# EAGLE design rapidshark_mark_6.12 (EAGLE 6.5.0)
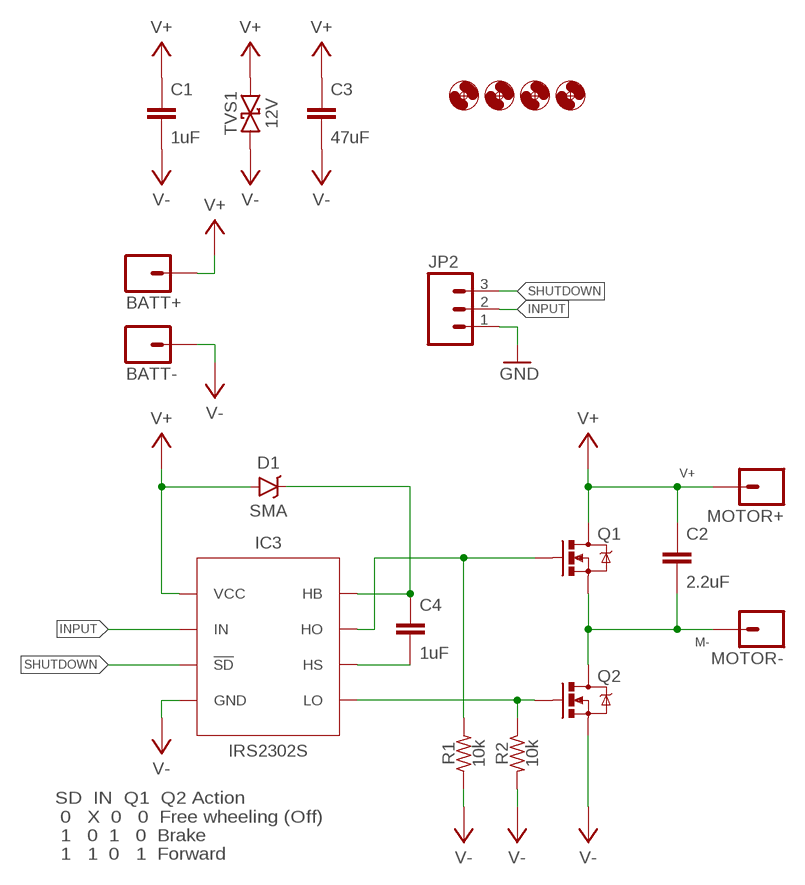
[diagram p0: schematic, sheet 1]

## Parts
BATT+  M01PTH_2MM  [1X01_2MM]
BATT-  M01PTH_2MM  [1X01_2MM]
C1  1uF  CAPACITOR-CERAMICC0805  [C0805]
C2  2.2uF  CAPACITOR-CERAMICC0805  [C0805]
C3  47uF  CAPACITOR-CERAMICC1206  [C1206]
C4  1uF  CAPACITOR-CERAMICC0805  [C0805]
D1  SMA  DIODE-SCHOTTKYSMA  [SMA-DIODE-SCHOTTKY]
H1  HOLE#2  [HOLE-#2]
H2  HOLE#2  [HOLE-#2]
H3  HOLE#2  [HOLE-#2]
H4  HOLE#2  [HOLE-#2]
IC3  IRS2302S  [SO08]
JP2  M03PTH  [1X03]
MOTOR+  M01PTH_2MM  [1X01_2MM]
MOTOR-  M01PTH_2MM  [1X01_2MM]
Q1  MOSFET-NCHANNELPSMN4R0-30YLD  [LFPAK56]
Q2  MOSFET-NCHANNELPSMN4R0-30YLD  [LFPAK56]
R1  10k  RESISTORR0805  [R0805]
R2  10k  RESISTORR0805  [R0805]
TVS1  12V  TVSSMA  [SMA-DIODE-TVS-BIDIR]

## Nets
GND: JP2.1
INPUT: IC3.2(IN) JP2.2
M-: C2.2 MOTOR-.1 Q1.1(S) Q1.2(S) Q1.3(S) Q2.MB@1(D) Q2.MB@2(D)
N$2: IC3.7(HO) Q1.4(G) R1.2
N$3: IC3.5(LO) Q2.4(G) R2.1
N$6: C4.1 D1.C IC3.8(HB)
N$7: C4.2 IC3.6(HS)
SHUTDOWN: IC3.3(!SD) JP2.3
V+: BATT+.1 C1.1 C2.1 C3.1 D1.A IC3.1(VCC) MOTOR+.1 Q1.MB@1(D) Q1.MB@2(D) TVS1.1
V-: BATT-.1 C1.2 C3.2 IC3.4(GND) Q2.1(S) Q2.2(S) Q2.3(S) R1.1 R2.2 TVS1.2

## Notes on the sheet
- SD  IN  Q1  Q2 Action
   0   X  0   0  Free wheeling (Off)
   1   0  1   0  Brake
   1   1  0   1  Forward

## Library data of the parts
BATT+ BATT- MOTOR+ MOTOR- = A_butts:M01: Header 1 Standard 1-pin 0.1" header. Use with straight break away headers (SKU : PRT-00116), right angle break away headers (PRT-00553), swiss pins (PRT-00743), machine pins (PRT-00117), and female headers (PRT-00115).
C1-C4 = A_butts:CAPACITOR-CERAMIC: CAPACITOR, European symbol
D1 = A_butts:DIODE-SCHOTTKY: Schottky diodes in SFE's production catalog BAT20J 1A 23V 0.62Vf RB751 120mA 40V 0.37Vf PMEG4005EJ 0.5A 40V 0.42Vf MBRA140 1A 40V 0.5Vf B340A 3A 40V SMA
H1-H4 = A_butts:HOLE: MOUNTING HOLE with drill center marker
IC3 = A_butts:IRS2302S
JP2 = A_butts:M03: Header 3 Standard 3-pin 0.1" header. Use with straight break away headers (SKU : PRT-00116), right angle break away headers (PRT-00553), swiss pins (PRT-00743), machine pins (PRT-00117), and female headers (PRT-00115). Molex polarized connector foot print use with SKU : PRT-08232 with associated crimp pins and housings.
Q1 Q2 = A_butts:MOSFET-NCHANNEL: Common NMOSFET Parts MFG P/N Store ID Prod ID FDD8780 TRANS-09984 SI7820DN TRANS-11055 FDS6630A IC-08089 2N7002PW TRANS-11151 FQP30N06L COM-10213 TRANS-10060 BSS123LT1G TRANS-08345 BSS138 TRANS-00830 BS170 2N7000
R1 R2 = A_butts:RESISTOR: RESISTOR, American symbol
TVS1 = A_butts:TVS: Transient voltage suppressor- prevents ESD on inputs. Ignore package description- MBRA140 is NOT this type of part!!!

## Board
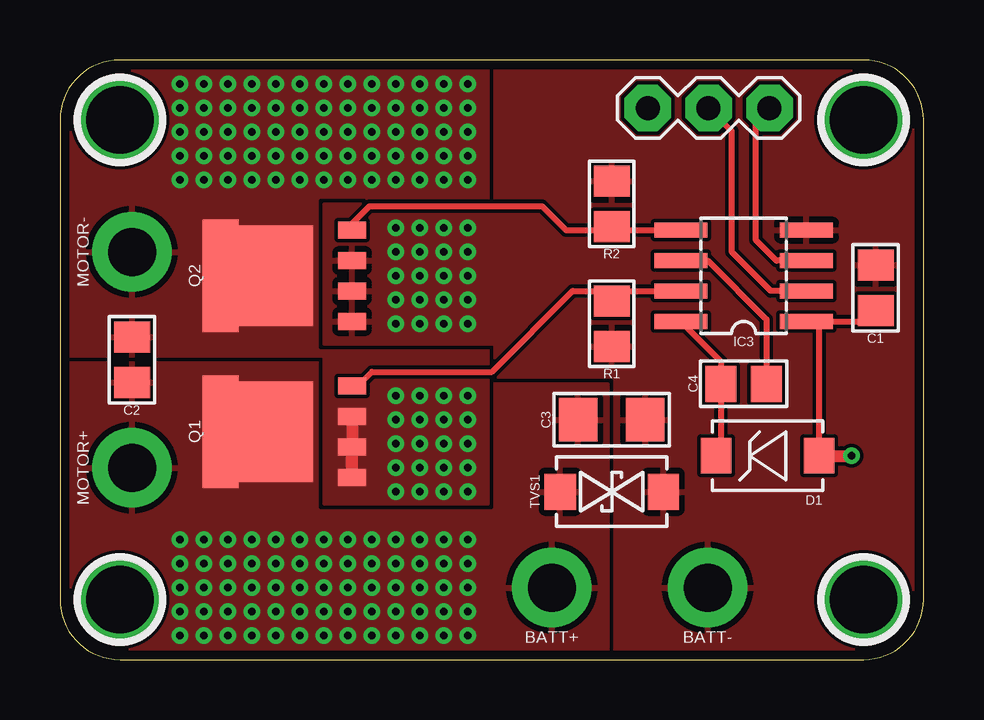
[diagram p1: board, top side]
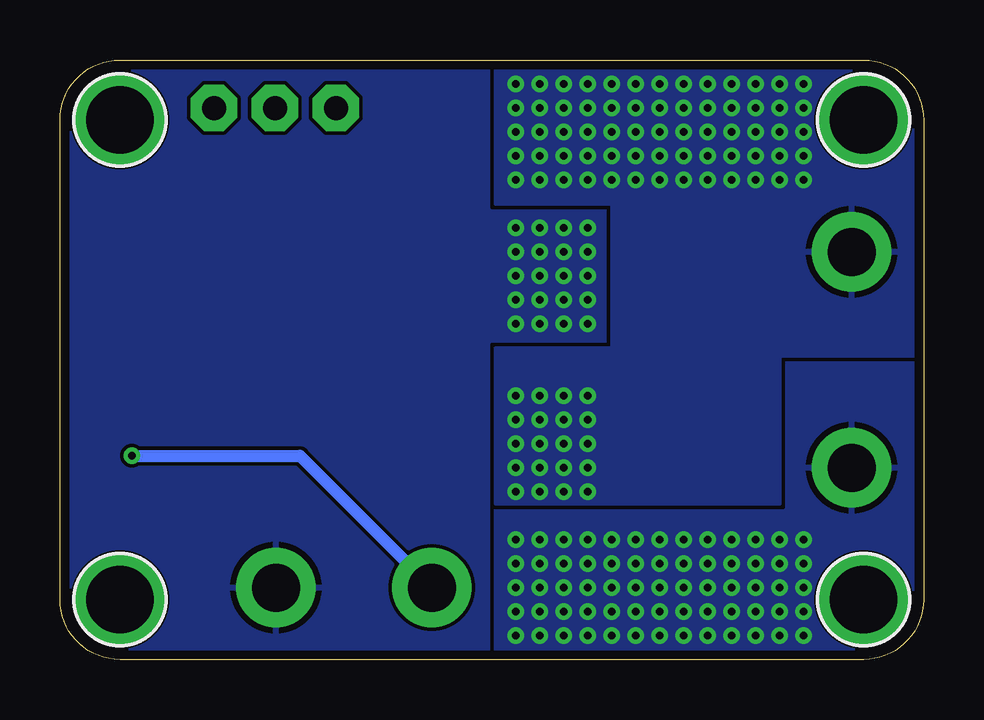
[diagram p2: board, bottom side, seen from below]

Size 36 x 25 mm. Coordinates in mm from the lower left corner, seen from the top.
Outline: 0,22.5 0,2.5 arc90 2.5,0 33.5,0 arc90 36,2.5 36,22.5 arc90 33.5,25 2.5,25 arc90 0,22.5
Copper layers (1*16): Top 0.0356mm / dielectric 1.5011mm / Bottom 0.0356mm
Design rules "LaenPCBOrder_2": minimum track width 6mil, minimum drill 13mil, track to track 6mil, track to pad 6mil, pad to pad 6mil, via to via 6mil, smd to smd 6mil, copper to edge 15mil, drill to drill 6mil, minimum pad ring 7mil, minimum via ring 7mil, stop-mask expansion 3mil, vias tented up to drill 20mil, thermal gap 10mil

### Footprints (pad centres in the part's own frame; a part is rotated, then mirrored left to right if it is on the bottom)
1X01_2MM = drill 2 pad 3.302: 1 0,0
C0805 = smd 1.3 x 1.5: 1 -0.95,0; 2 0.95,0
C1206 = smd 1.6 x 1.8: 1 -1.4,0; 2 1.4,0
SMA-DIODE-SCHOTTKY = smd 1.27 x 1.47: A -2.15,0; C 2.15,0
HOLE-#2 = drill 2.8 pad 3.81: P$1 0,0
SO08 = smd 0.61 x 2.21: 1 -1.905,-2.616; 2 -0.635,-2.616; 3 0.635,-2.616; 4 1.905,-2.616; 5 1.905,2.616; 6 0.635,2.616; 7 -0.635,2.616; 8 -1.905,2.616
1X03 = drill 1 pad 1.93 octagon: 1 0,0; 2 2.54,0; 3 5.08,0
LFPAK56 = smd 0.7 x 1.15: 1 -1.905,-3.175; 2 -0.635,-3.175; 3 0.635,-3.175; 4 1.905,-3.175 | smd 4.2 x 3.1: MB@1 0,0 | smd 4.7 x 1.5: MB@2 0,2.3
R0805 = smd 1.3 x 1.5: 1 -0.95,0; 2 0.95,0
SMA-DIODE-TVS-BIDIR = smd 1.3 x 1.5: 1 -2.15,0; 2 2.15,0

### Placement (x,y rotation side)
BATT+  20.5,3 180 top
BATT-  27,3 180 top
C1  34,15.5 90 top
C2  3,12.5 90 top
C3  23,10 0 top
C4  28.5,11.5 0 top
D1  29.5,8.5 180 top
H1  2.5,2.5 0 top
H2  2.5,22.5 0 top
H3  33.5,22.5 0 top
H4  33.5,2.5 0 top
IC3  28.5,16 90 top
JP2  24.5,23 0 top
MOTOR+  3,8 90 top
MOTOR-  3,17 90 top
Q1  9,9.5 90 top
Q2  9,16 90 top
R1  23,14 90 top
R2  23,19 90 top
TVS1  23,7 0 top

### Tracks (layer width: path | path; a pad name or v marks a point on that pad's centre or on a via)
INPUT
  Top 0.25: IC3.2 29.64,15.37 28,17 28,22.04 JP2.2
M-  (via drill 0.33)
  Top 0.5: Q1.1 Q1.2 Q1.3
  other vias: 6,24 6,23 6,22 6,21 6,20 7,24 7,23 7,22 7,21 7,20 8,24 8,23 8,22 8,21 8,20 9,24 9,23 9,22 9,21 9,20 10,24 10,23 10,22 10,21 10,20 11,24 11,23 11,22 11,21 11,20 12,24 12,23 12,22 12,21 12,20 13,24 13,23 13,22 13,21 13,20 14,24 14,23 14,22 14,21 14,20 15,24 15,23 15,22 15,21 15,20 16,24 16,23 16,22 16,21 16,20 17,24 17,23 17,22 17,21 17,20 5,24 5,23 5,22 5,21 5,20 14,11 15,11 16,11 17,11 14,10 14,9 15,9 15,10 16,10 16,9 17,9 17,10 14,8 15,8 16,8 17,8 17,7 16,7 15,7 14,7
  pour Top (rank 2): 0,12.65 17.85,12.65 17.85,25 2.5,25 arc90 0,22.5
  pour Bottom: 0,12.65 13,12.65 13,19 17.85,19 17.85,25 2.5,25 arc90 0,22.5
  pour Top (rank 2, no thermals): 11,12.85 17.85,12.85 17.85,6.5 11,6.5
  pour Bottom: 6,14.5 6,6.5 17.85,6.5 17.85,13 13,13 13,14.5
N$2
  Top 0.25: Q1.4 12.4,11.4 13,12 18,12 21.36,15.37 23,15.37 | 23,15.37 IC3.7 | R1.2 23,15.37
N$3
  Top 0.25: Q2.4 12.18,18.18 12.9,18.9 20.1,18.9 21.09,17.91 23,17.91 | 25.79,18 IC3.5 23,17.91 | R2.1 23,17.91
N$6
  Top 0.25: IC3.8 27.55,12.43 C4.1 27.55,8.7 D1.C
N$7
  Top 0.25: IC3.6 27,16.64 29.45,14.19 C4.2
SHUTDOWN
  Top 0.25: IC3.3 29.86,16.64 29,17.5 29,22.42 JP2.3
V+  (via drill 0.33)
  Top 0.25: IC3.1 31.5,14.1 | 31.5,14.1 33.55,14.1 C1.1 | D1.A 31.65,13.95 31.5,14.1
  Top 0.5: D1.A v33,8.5
  Bottom 0.5: v33,8.5 26,8.5 BATT+.1
  other vias: 6,5 6,4 6,3 6,2 6,1 7,5 7,4 7,3 7,2 7,1 8,5 8,4 8,3 8,2 8,1 9,5 9,4 9,3 9,2 9,1 10,5 10,4 10,3 10,2 10,1 11,5 11,4 11,3 11,2 11,1 12,5 12,4 12,3 12,2 12,1 13,5 13,4 13,3 13,2 13,1 14,5 14,4 14,3 14,2 14,1 15,5 15,4 15,3 15,2 15,1 16,5 16,4 16,3 16,2 16,1 17,5 17,4 17,3 17,2 17,1 5,5 5,4 5,3 5,2 5,1
  pour Top (rank 3): 0,12.5 17.85,12.5 17.85,11.5 22.85,11.5 22.85,0 2.5,0 arc-90 0,2.5
  pour Bottom (rank 3): 0,12.5 17.85,12.5 17.85,0 2.5,0 arc-90 0,2.5
V-  (via drill 0.33)
  other vias: 14,18 15,18 16,18 17,18 14,17 14,16 15,16 15,17 16,17 16,16 17,16 17,17 14,15 15,15 16,15 17,15 17,14 16,14 15,14 14,14
  pour Top (rank 6): 33.5,0 2.5,0 arc-90 0,2.5 0,22.5 arc-90 2.5,25 33.5,25 arc-90 36,22.5 36,2.5 arc-90
  pour Bottom (rank 6): 33.5,0 2.5,0 arc-90 0,2.5 0,22.5 arc-90 2.5,25 33.5,25 arc-90 36,22.5 36,2.5 arc-90
  pour Top: 19,13.15 19,19 11,19 11,13.15